# Altium schematic sheet AFC01-S40FCA-001_AFC01-S40FCA-00.schdoc
size 124 x 124 mm
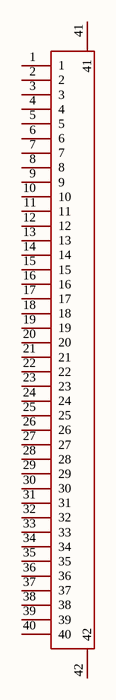
[diagram p0: AFC01-S40FCA-001_AFC01-S40FCA-00.schdoc]

## Parts
FPC?  AFC01-S40FCA-00  [FPC-SMD_AFC01-S40FCA-00]  (value not drawn)

## Nets

Not connected (* = marked no-connect by the designer): FPC? 1 2 3 4 5 6 7 8 9 10 11 12 13 14 15 16 17 18 19 20 21 22 23 24 25 26 27 28 29 30 31 32 33 34 35 36 37 38 39 40 41 42

## Library data of the parts
FPC? = AFC01-S40FCA-00: Manufacturer: JS(钜硕电子); Add into BOM: yes; Locking Feature: 翻盖式; Number of Contacts: 40P; Pitch: 0.5mm; FFC, FCB Thickness: 0.3mm; Symbol: AFC01-S40FCA-00; Device: AFC01-S40FCA-00; LCSC Part Name: 间距:0.5mm P数:40P 翻盖式 下接; Supplier Part: C262674; Manufacturer Part: AFC01-S40FCA-00; Supplier Footprint: SMD,P=0.5mm,卧贴; JLCPCB Part Class: Extended Part; Datasheet: https://item.szlcsc.com/datasheet/AFC01-S40FCA-00/253933.html; Supplier: LCSC; Convert to PCB: yes; Contact Type: 下接; Mounting Type: 卧贴; Height Above Board: 2mm